# Altium schematic sheet main_controller_blk.SchDoc
size A4; Engineer: JBayalas; DocumentNumber: 9; Revision: V2.0; SheetNumber: 9; SheetTotal: 11
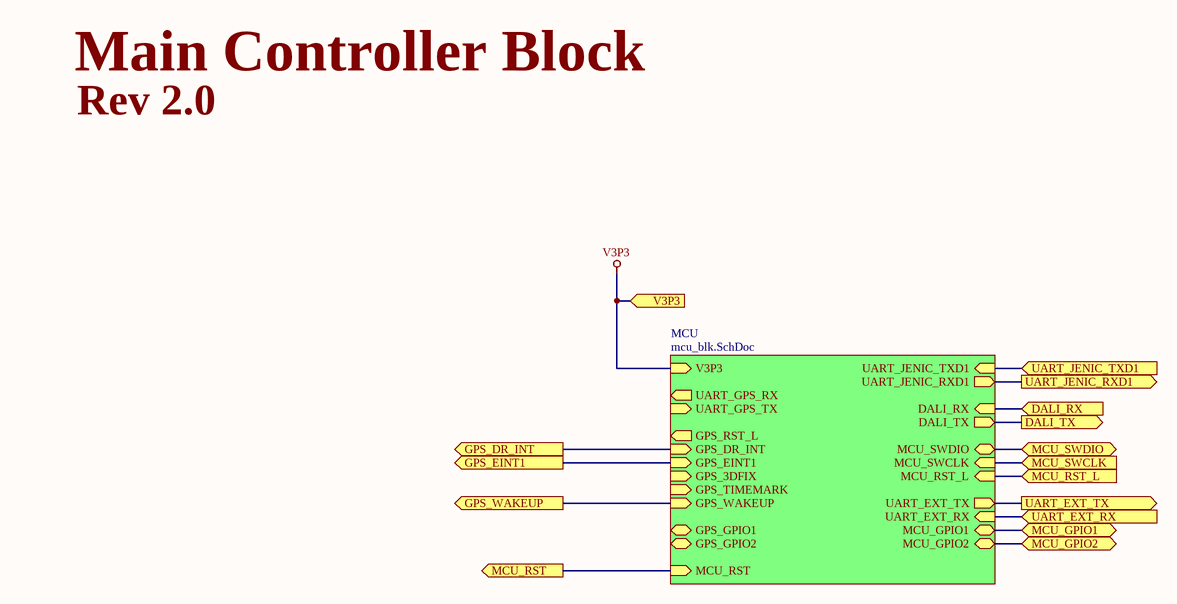
[diagram p0: main_controller_blk.SchDoc]

## Sub-sheets
MCU = mcu_blk.SchDoc: DALI_TX (out), DALI_RX (in), UART_JENIC_TXD1 (in), UART_JENIC_RXD1 (out), V3P3 (in), MCU_SWDIO (bidir), MCU_SWCLK (in), MCU_RST_L (in), UART_GPS_RX (out), UART_GPS_TX (in), GPS_RST_L (out), GPS_DR_INT (in), GPS_EINT1 (in), GPS_3DFIX (in), GPS_TIMEMARK (in), GPS_WAKEUP (in), GPS_GPIO1 (bidir), GPS_GPIO2 (bidir), UART_EXT_RX (in), UART_EXT_TX (out), MCU_GPIO2 (bidir), MCU_GPIO1 (bidir), MCU_RST (in)

## Ports
DALI_RX (in), DALI_TX (out), GPS_DR_INT (out), GPS_EINT1 (out), GPS_WAKEUP (out), MCU_GPIO1 (bidir), MCU_GPIO2 (bidir), MCU_RST (out), MCU_RST_L (in), MCU_SWCLK (in), MCU_SWDIO (bidir), UART_EXT_RX (in), UART_EXT_TX (out), UART_JENIC_RXD1 (out), UART_JENIC_TXD1 (in), V3P3 (in)

## Nets
V3P3: port V3P3, sheet MCU/V3P3
DALI_RX: port DALI_RX, sheet MCU/DALI_RX
DALI_TX: port DALI_TX, sheet MCU/DALI_TX
GPS_DR_INT: port GPS_DR_INT, sheet MCU/GPS_DR_INT
GPS_EINT1: port GPS_EINT1, sheet MCU/GPS_EINT1
GPS_WAKEUP: port GPS_WAKEUP, sheet MCU/GPS_WAKEUP
MCU_GPIO1: port MCU_GPIO1, sheet MCU/MCU_GPIO1
MCU_GPIO2: port MCU_GPIO2, sheet MCU/MCU_GPIO2
MCU_RST: port MCU_RST, sheet MCU/MCU_RST
MCU_RST_L: port MCU_RST_L, sheet MCU/MCU_RST_L
MCU_SWCLK: port MCU_SWCLK, sheet MCU/MCU_SWCLK
MCU_SWDIO: port MCU_SWDIO, sheet MCU/MCU_SWDIO
UART_EXT_RX: port UART_EXT_RX, sheet MCU/UART_EXT_RX
UART_EXT_TX: port UART_EXT_TX, sheet MCU/UART_EXT_TX
UART_JENIC_RXD1: port UART_JENIC_RXD1, sheet MCU/UART_JENIC_RXD1
UART_JENIC_TXD1: port UART_JENIC_TXD1, sheet MCU/UART_JENIC_TXD1

## Notes on the sheet
- Main Controller Block
- Rev 2.0
- Title:
- Sheet:
- Date:
- of
- Project:
- Revision:
- Engineer:
- Wi4B S.r.l